# Altium schematic sheet Front_Panel.SchDoc: Nitrous Controller- Head unit
size A; DrawnBy: Stephane Gilbert
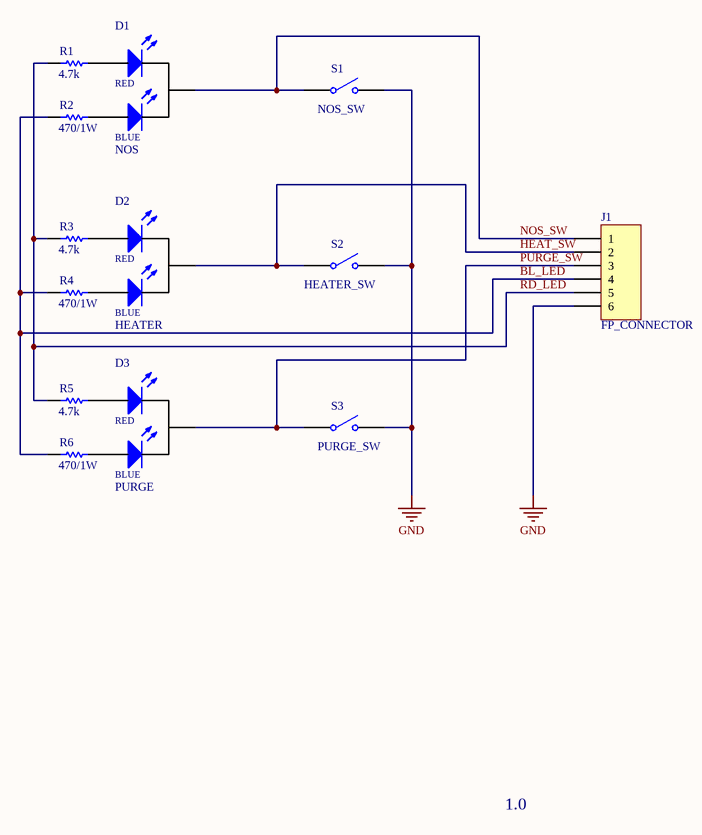
[diagram p0: Front_Panel.SchDoc]

## Parts
D1  NOS
D2  HEATER
D3  PURGE
J1  FP_CONNECTOR  [MOLEX_51036_6POS]
R1  value 4.7k  [AXIAL-0.4]  (hidden comment: Res1)
R2  value 470/1W  [AXIAL-0.6]  (hidden comment: Res1)
R3  value 4.7k  [AXIAL-0.4]  (hidden comment: Res1)
R4  value 470/1W  [AXIAL-0.6]  (hidden comment: Res1)
R5  value 4.7k  [AXIAL-0.4]  (hidden comment: Res1)
R6  value 470/1W  [AXIAL-0.6]  (hidden comment: Res1)
S1  NOS_SW  [PA4_DPST]
S2  HEATER_SW  [PA4_DPST]
S3  PURGE_SW  [PA4_SPST]

## Nets
GND: J1.6 S1.2(NO) S2.2(NO) S3.2(NO)
BL_LED: J1.4 R2.1 R4.1 R6.1
HEAT_SW: D2.2(K) J1.2 S2.1(COMMON)
NOS_SW: D1.2(K) J1.1 S1.1(COMMON)
PURGE_SW: D3.2(K) J1.3 S3.1(COMMON)
RD_LED: J1.5 R1.1 R3.1 R5.1
NetD1_1: D1.1(A1) R1.2
NetD1_3: D1.3(A2) R2.2
NetD2_1: D2.1(A1) R3.2
NetD2_3: D2.3(A2) R4.2
NetD3_1: D3.1(A1) R5.2
NetD3_3: D3.3(A2) R6.2

## Notes on the sheet
- 1.0
- (in symbol LED_DUAL_COLOR_CC) RED; BLUE

## Library data of the parts
D1-D3 = LED_DUAL_COLOR_CC: Red/Blue LED; PartNo: XLMDKCBD59M
J1 = Header 6: Header, 6-Pin; LatestRevisionDate: 17-Jul-2002; LatestRevisionNote: Re-released for DXP Platform.; Publisher: Altium Limited
R1-R6 = Res1: Resistor; Published: 8-Jun-2000; LatestRevisionDate: 17-Jul-2002; LatestRevisionNote: Re-released for DXP Platform.; PackageReference: AXIAL-0.3; Publisher: Altium Limited; PackageDescription: Axial Device, Thru-Hole; 2 Leads; 0.3 in Pin Spacing
S1-S3 = SW-SPST: Single-Pole, Single-Throw Switch; Published: 24-Mar-1999; LatestRevisionDate: 17-Jul-2002; LatestRevisionNote: Re-released for DXP Platform.; PackageReference: SPST-2; Publisher: Altium Limited; PackageDescription: Switch; 2 Leads